# EAGLE design HV Board rev3 (EAGLE 9.0.1)
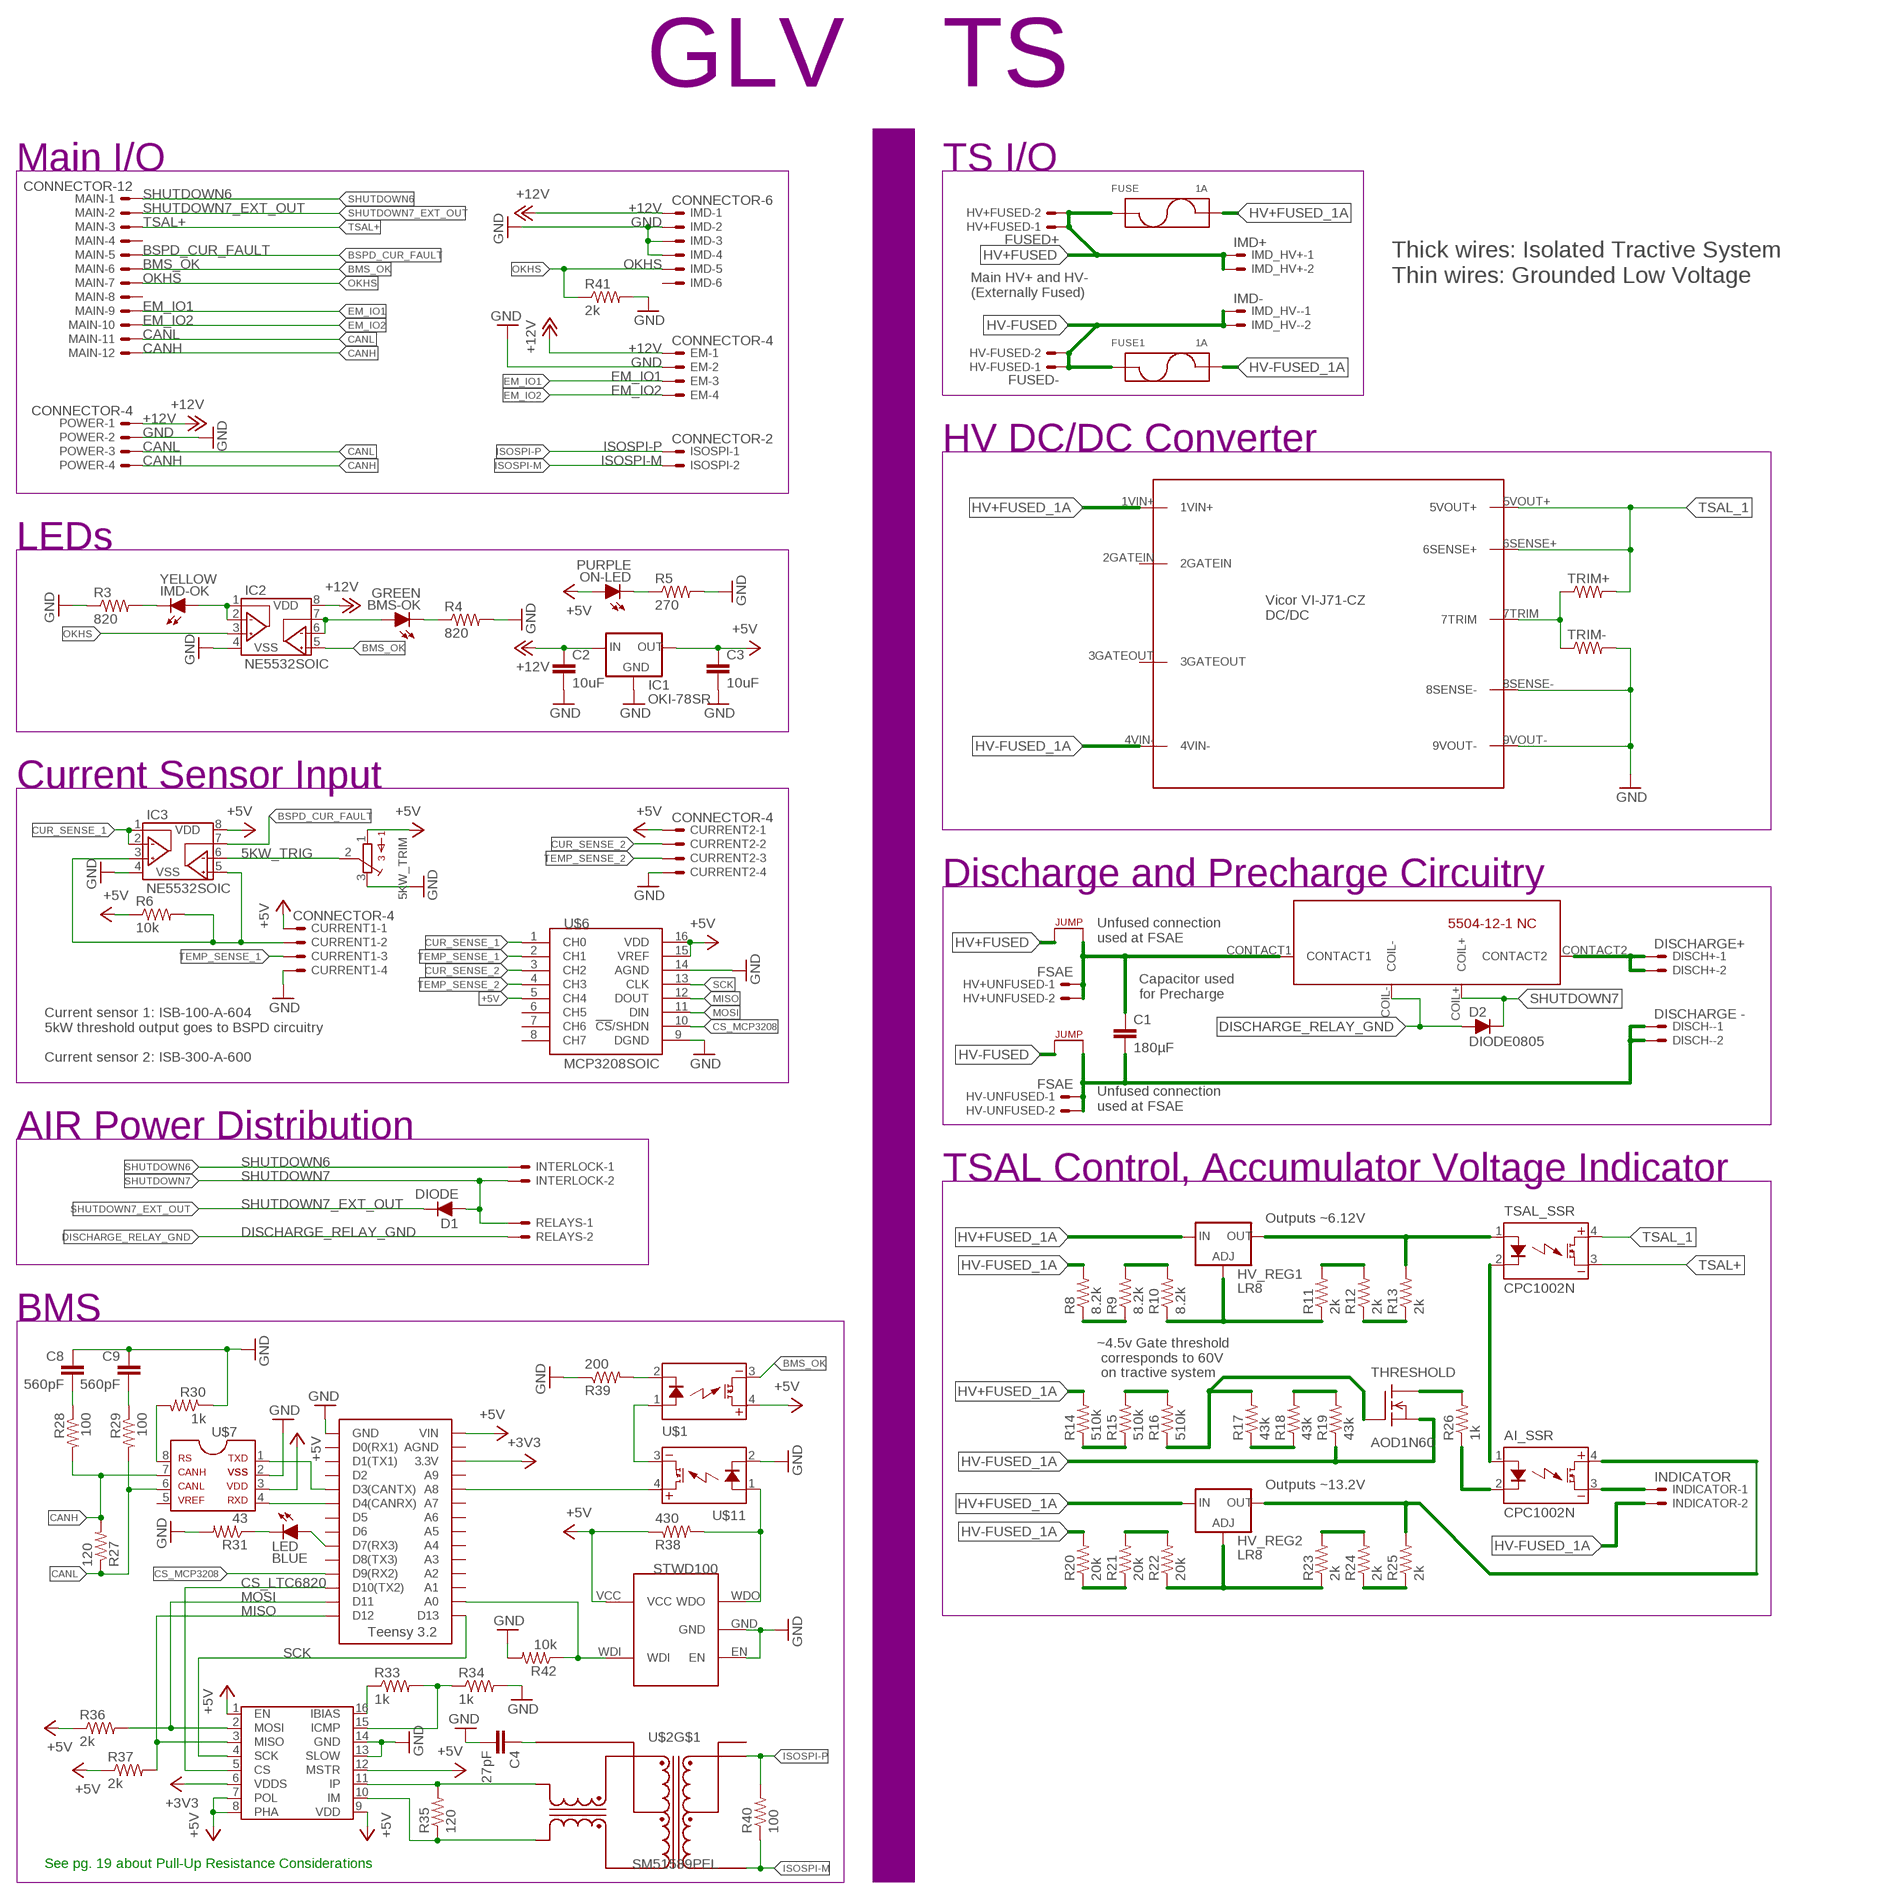
[diagram p0: schematic, sheet 1]

## Parts
5KW_TRIM  TRIMPOT_3296C  [TRIMPOT_3296]
AI_SSR  CPC1002N  [SOP04]
BMS-OK  GREEN  LED-0805  [LED-805]
C1  180µF  CAP  [LLS2V221MELZ]
C2  10uF  CAP0805  [0805]
C3  10uF  CAP0805  [0805]
C4  27pF  CAP0805  [0805]
C8  560pF  CAP0805  [0805]
C9  560pF  CAP0805  [0805]
CURRENT1  CONNECTOR-4  [MINIFIT_5566-4]
CURRENT2  CONNECTOR-4  [MINIFIT_5566-4]
D1  DIODE  DIODEDO-41  [DO-41]
D2  DIODE0805  [0805_D]
DISCH+  DISCHARGE+  MINIFIT_5566-2  [MINIFIT_5566-2]
DISCH-  DISCHARGE -  MINIFIT_5566-2  [MINIFIT_5566-2]
EM  CONNECTOR-4  CONNECTOR-4NANO-FIT-VERTICAL-4  [NANO-FIT_VERTICAL-4]
FUSE  1A  FUSE_5X20MM  [0751.0110]
FUSE1  1A  FUSE_5X20MM  [0751.0110]
HV+FUSED  FUSED+  MINIFIT_5566-2  [MINIFIT_5566-2]
HV+UNFUSED  FSAE  CONNECTOR-2  [MINIFIT_5566-2]
HV-FUSED  FUSED-  MINIFIT_5566-2  [MINIFIT_5566-2]
HV-UNFUSED  FSAE  CONNECTOR-2  [MINIFIT_5566-2]
HV_REG1  LR8  HV_LIN_REG_LR8SMD  [TO-252]
HV_REG2  LR8  HV_LIN_REG_LR8SMD  [TO-252]
IC1  OKI-78SR  [OKI-78SR]
IC2  NE5532SOIC  [SOIC-08]
IC3  NE5532SOIC  [SOIC-08]
IMD  CONNECTOR-6  CONNECTOR-6NANO-FIT_VERTICAL-6  [NANO-FIT_VERTICAL-6]
IMD-OK  YELLOW  LED-0805  [LED-805]
IMD_HV+  IMD+  CONNECTOR-2  [MINIFIT_5566-2]
IMD_HV-  IMD-  CONNECTOR-2  [MINIFIT_5566-2]
INDICATOR  INDICATOR  MINIFIT_5566-2  [MINIFIT_5566-2]
INTERLOCK  MINIFIT_5566-2  [MINIFIT_5566-2]
ISOSPI  CONNECTOR-2  CONNECTOR-2NANO-FIT_VERTICAL-2  [NANO-FIT_VERTICAL-2]
LED  BLUE  LED-0805  [LED-805]
MAIN  CONNECTOR-12  [MINIFIT_5566-12]
ON-LED  PURPLE  LED-0805  [LED-805]
POWER  CONNECTOR-4  [MINIFIT_5566-4]
R3  820  RESISTOR0805-RES  [0805]
R4  820  RESISTOR0805-RES  [0805]
R5  270  RESISTOR0805-RES  [0805]
R6  10k  RESISTOR0805-RES  [0805]
R8  8.2k  RESISTOR0805-RES  [0805]
R9  8.2k  RESISTOR0805-RES  [0805]
R10  8.2k  RESISTOR0805-RES  [0805]
R11  2k  RESISTOR0805-RES  [0805]
R12  2k  RESISTOR0805-RES  [0805]
R13  2k  RESISTOR0805-RES  [0805]
R14  510k  RESISTOR0805-RES  [0805]
R15  510k  RESISTOR0805-RES  [0805]
R16  510k  RESISTOR0805-RES  [0805]
R17  43k  RESISTOR0805-RES  [0805]
R18  43k  RESISTOR0805-RES  [0805]
R19  43k  RESISTOR0805-RES  [0805]
R20  20k  RESISTOR0805-RES  [0805]
R21  20k  RESISTOR0805-RES  [0805]
R22  20k  RESISTOR0805-RES  [0805]
R23  2k  RESISTOR0805-RES  [0805]
R24  2k  RESISTOR0805-RES  [0805]
R25  2k  RESISTOR0805-RES  [0805]
R26  1k  RESISTOR0805-RES  [0805]
R27  120  RESISTOR0805-RES  [0805]
R28  100  RESISTOR0805-RES  [0805]
R29  100  RESISTOR0805-RES  [0805]
R30  1k  RESISTOR0805-RES  [0805]
R31  43  RESISTOR0805-RES  [0805]
R33  1k  RESISTOR0805-RES  [0805]
R34  1k  RESISTOR0805-RES  [0805]
R35  120  RESISTOR0805-RES  [0805]
R36  2k  RESISTOR0805-RES  [0805]
R37  2k  RESISTOR0805-RES  [0805]
R38  430  RESISTOR0805-RES  [0805]
R39  200  RESISTOR0805-RES  [0805]
R40  100  RESISTOR0805-RES  [0805]
R41  2k  RESISTOR0805-RES  [0805]
R42  10k  RESISTOR0805-RES  [0805]
RELAYS  MINIFIT_5566-2  [MINIFIT_5566-2]
THRESHOLD  AOD1N60  N-CHANNEL_MOSFETAOD1N60  [TO-252]
TRIM+  RESISTOR0805-RES  [0805]
TRIM-  RESISTOR0805-RES  [0805]
TSAL_SSR  CPC1002N  [SOP04]
U$1  CPC1002N  [SOP04]
U$2  SM51589PEL  [SM51589PEL]
U$3  JUMPER.3  [AXIAL-0.3]
U$4  JUMPER.3  [AXIAL-0.3]
U$5  HV_DCDC_VI-J71-CZ  [HV_DCDC_VI-J71-CZ]
U$6  MCP3208SOIC  [SOIC-16]
U$7  MCP2551  [SOIC-08]
U$8  LTC6820  [MSOP-16]
U$9  TEENSY_3.2_SIMPLE  [TEENSY_3.2_SIMPLE]
U$10  STWD100  [SOT23-5]
U$11  CPC1002N  [SOP04]
U$12  5504-12-1-NC  [5504-12-1-NC]

## Nets
5KW_TRIG: 5KW_TRIM.2 IC3.6(VINB-)
+3V3: U$8.6(VDDS) U$9.3.3V
+5V: 5KW_TRIM.1 C3.1 CURRENT1.1 CURRENT2.1 IC1.3(OUT) IC3.8(VDD) ON-LED.A R6.1 R36.1 R37.1 R38.1 U$1.4(DC+) U$6.5(CH4) U$6.15(VREF) U$6.16(VDD) U$7.3 U$8.1(EN) U$8.7(POL) U$8.8(PHA) U$8.9(VDD) U$8.12(MSTR) U$9.VIN U$10.VCC
+12V: C2.1 EM.P$1 IC1.1(IN) IC2.8(VDD) IMD.P$1 POWER.1
BMS_OK: IC2.5(VINB+) MAIN.6 U$1.3(DC-)
BMS_WATCH: U$1.1(CONTROL+) U$11.3(DC-)
BSPD_CUR_FAULT: IC3.7(VOUTB) MAIN.5
CANH: MAIN.12 POWER.4 R27.2 R28.2 U$7.7
CANL: MAIN.11 POWER.3 R27.1 R29.2 U$7.6
CS_LTC6820: U$8.5(CS) U$9.D10(TX2)
CS_MCP3208: U$6.10(!CS!/SHDN) U$9.D9(RX2)
CUR_SENSE_1: IC3.1(VOUTA) IC3.2(VINA-) U$6.1(CH0)
CUR_SENSE_1_RAW: CURRENT1.2 IC3.3(VINA+) IC3.5(VINB+) R6.2
CUR_SENSE_2: CURRENT2.2 U$6.3(CH2)
DISCHARGE_RELAY_GND: D2.A RELAYS.2 U$12.COIL-
EM_IO1: EM.P$3 MAIN.9
EM_IO2: EM.P$4 MAIN.10
GND: 5KW_TRIM.3 C2.2 C3.2 C4.2 C8.1 C9.1 CURRENT1.4 CURRENT2.4 EM.P$2 IC1.2(GND) IC2.4(VSS) IC3.4(VSS) IMD.P$2 IMD.P$3 IMD.P$4 POWER.2 R3.1 R4.2 R5.2 R30.1 R31.2 R34.2 R39.1 R41.2 R42.2 TRIM-.2 U$5.8SENSE- U$5.9VOUT- U$6.9(DGND) U$6.14(AGND) U$7.2 U$8.13(SLOW) U$8.14(GND) U$9.GND U$10.EN U$10.GND U$11.2(CONTROL-)
HV+FUSED: FUSE.L1(P1) FUSE.L2(P1) HV+FUSED.1 HV+FUSED.2 IMD_HV+.1 IMD_HV+.2 U$3.P$1
HV+FUSED_1A: FUSE.R1(P2) FUSE.R2(P2) HV_REG1.1(IN) HV_REG2.1(IN) R14.2 U$5.1VIN+
HV+UNFUSED_FSAE: C1.P$1 HV+UNFUSED.1 HV+UNFUSED.2 U$3.P$2 U$12.CONTACT1
HV+UNFUSED_FSAE_DISCHARGE: DISCH+.1 DISCH+.2 U$12.CONTACT2
HV-FUSED: FUSE1.L1(P1) FUSE1.L2(P1) HV-FUSED.1 HV-FUSED.2 IMD_HV-.1 IMD_HV-.2 U$4.P$1
HV-FUSED_1A: FUSE1.R1(P2) FUSE1.R2(P2) INDICATOR.2 R8.2 R19.1 R20.2 THRESHOLD.3(S) U$5.4VIN-
HV-UNFUSED_FSAE: C1.P$2 DISCH-.1 DISCH-.2 HV-UNFUSED.1 HV-UNFUSED.2 U$4.P$2
ISOSPI-M: ISOSPI.P$2 R40.1 U$2.3(MX-)
ISOSPI-P: ISOSPI.P$1 R40.2 U$2.2(MX+)
MISO: R37.2 U$6.12(DOUT) U$8.3(MISO) U$9.D12
MOSI: R36.2 U$6.11(DIN) U$8.2(MOSI) U$9.D11
N$1: AI_SSR.4(DC+) HV_REG2.2(TAB)(OUT) R25.2
N$2: HV_REG1.2(TAB)(OUT) R13.2 TSAL_SSR.1(CONTROL+)
N$3: ON-LED.C R5.1
N$4: R39.2 U$1.2(CONTROL-)
N$5: AI_SSR.2(CONTROL-) R26.1
N$6: AI_SSR.1(CONTROL+) TSAL_SSR.2(CONTROL-)
N$7: AI_SSR.3(DC-) INDICATOR.1
N$8: R8.1 R9.1
N$9: R26.2 THRESHOLD.2(TAB)(D)
N$10: R14.1 R15.1
N$11: R15.2 R16.2
N$12: R17.1 R18.1
N$13: R18.2 R19.2
N$14: R9.2 R10.2
N$15: HV_REG2.3(ADJ) R22.1 R23.1
N$16: R11.2 R12.2
N$17: R12.1 R13.1
N$18: HV_REG1.3(ADJ) R10.1 R11.1
N$19: R23.2 R24.2
N$20: R24.1 R25.1
N$21: R21.2 R22.2
N$22: R16.1 R17.2 THRESHOLD.1(G)
N$23: R20.1 R21.1
N$25: U$7.1 U$9.D3(CANTX)
N$26: R30.2 U$7.8
N$27: C8.2 R28.1
N$28: C9.2 R29.1
N$29: LED.C R31.1
N$31: R33.1 U$8.16(IBIAS)
N$32: R33.2 R34.1 U$8.15(ICMP)
N$33: R35.1 U$2.22(TD-) U$8.10(IM)
N$34: R35.2 U$2.23(TD+) U$8.11(IP)
N$35: C4.1 U$2.24(TCT)
N$36: U$7.4 U$9.D4(CANRX)
N$37: LED.A U$9.D7(RX3)
N$38: R38.2 U$10.WDO U$11.1(CONTROL+)
N$40: U$9.A8 U$11.4(DC+)
N$42: IC2.1(VOUTA) IC2.2(VINA-) IMD-OK.A
N$43: BMS-OK.A IC2.6(VINB-) IC2.7(VOUTB)
N$44: BMS-OK.C R4.1
N$45: IMD-OK.C R3.2
N$50: R42.1 U$9.A0 U$10.WDI
OKHS: IC2.3(VINA+) IMD.P$5 MAIN.7 R41.1
SCK: U$6.13(CLK) U$8.4(SCK) U$9.D13
SHUTDOWN6: INTERLOCK.1 MAIN.1
SHUTDOWN7: D1.A D2.C INTERLOCK.2 RELAYS.1 U$12.COIL+
SHUTDOWN7_EXT_OUT: D1.C MAIN.2
TEMP_SENSE_1: CURRENT1.3 U$6.2(CH1)
TEMP_SENSE_2: CURRENT2.3 U$6.4(CH3)
TRIM: TRIM+.1 TRIM-.1 U$5.7TRIM
TSAL+: MAIN.3 TSAL_SSR.3(DC-)
TSAL_1: TRIM+.2 TSAL_SSR.4(DC+) U$5.5VOUT+ U$5.6SENSE+
Unconnected: IMD.P$6 MAIN.4 MAIN.8 U$2.1(MCT) U$2.4(MCT) U$2.5(MX+) U$2.6(MX-) U$2.7(MCT) U$2.8(MX+) U$2.9(MX-) U$2.10(MCT) U$2.11(MX+) U$2.12(MX-) U$2.13(TD-) U$2.14(TD+) U$2.15(TCT) U$2.16(TD-) U$2.17(TD+) U$2.18(TCT) U$2.19(TD-) U$2.20(TD+) U$2.21(TCT) U$5.2GATEIN U$5.3GATEOUT U$6.6(CH5) U$6.7(CH6) U$6.8(CH7) U$7.5 U$9.A1 U$9.A2 U$9.A3 U$9.A4 U$9.A5 U$9.A6 U$9.A7 U$9.A9 U$9.AGND U$9.D0(RX1) U$9.D1(TX1) U$9.D2 U$9.D5 U$9.D6 U$9.D8(TX3)

## Notes on the sheet
- GLV
- TS
- Main I/O | TS I/O
- Thick wires: Isolated Tractive System
  Thin wires: Grounded Low Voltage
- Main HV+ and HV-
  (Externally Fused)
- HV DC/DC Converter
- LEDs
- Current Sensor Input
- Discharge and Precharge Circuitry
- Unfused connection
  used at FSAE
- Capacitor used
  for Precharge
- Current sensor 1: ISB-100-A-604
  5kW threshold output goes to BSPD circuitry
  
  Current sensor 2: ISB-300-A-600
- Unfused connection
  used at FSAE
- AIR Power Distribution
- TSAL Control, Accumulator Voltage Indicator
- Outputs ~6.12V
- BMS
- ~4.5v Gate threshold
   corresponds to 60V
   on tractive system
- Outputs ~13.2V
- See pg. 19 about Pull-Up Resistance Considerations

## Library data of the parts
5KW_TRIM = HyTechDevices:TRIMPOT_3296: 3296 Series 3/8" Square Trimmer Source <https://github.com/chiengineer/Eagle-Libraries/blob/master/Potentiometers/bourns.lbr>
AI_SSR TSAL_SSR U$1 U$11 = HyTechDevices:CPC1002N: IXYS Solid State Relay .7A
BMS-OK IMD-OK LED ON-LED = HyTechDevices:LED: Light Emitting Diode (LED) Source: Dangerous Prototypes Eagle Library <https://github.com/DangerousPrototypes/Eagle_Part_Library>
C1-C4 C8 C9 = HyTechDevices:CAP: Capacitor Standard 0603 ceramic capacitor, and 0.1" leaded capacitor.
CURRENT1 CURRENT2 POWER = HyTechDevices:CONNECTOR-4: Mini-Fit Junior connector 4 pole Source: http://www.molex.com; OC_FARNELL: unknown; OC_NEWARK: unknown
D1 D2 = HyTechDevices:DIODE: DIODE general purpose rectifier
DISCH+ DISCH- HV+FUSED HV-FUSED INDICATOR INTERLOCK RELAYS = HyTechDevices:MINIFIT_5566-2: Mini-Fit Junior connector 2 pole Source: http://www.molex.com; OC_FARNELL: 1822072; OC_NEWARK: unknown
EM = HyTechDevices:CONNECTOR-4: Mini-Fit Junior connector 4 pole Source: http://www.molex.com
FUSE FUSE1 = HyTechDevices:FUSE: Fuse/Fuseclips Keystone Electronics 3568 Fuse Mouser Part <http://www.mouser.com/ProductDetail/Keystone-Electronics/3568> Datasheet <http://www.mouser.com/ds/2/215/568-742601.pdf> Bussman/Eaton Midget Fuse Clip 1A3400 <http://www.mouser.com/ProductDetail/Bussmann-Eaton/BK-1A3400-09-R/?qs=sGAEpiMZZMuG%252bgnN5hGYGzzlAelq2OxnKqVSMVjq8I4%3d> Schurter 0751.0110 Brass Fuse Clip Datasheet <http://www.mouser.com/ds/2/358/typ_OG__Clip__5x20-2553.pdf>
HV+UNFUSED HV-UNFUSED IMD_HV+ IMD_HV- = HyTechDevices:CONNECTOR-2: Mini-Fit Junior connector 2 pole Source: http://www.molex.com; OC_FARNELL: 1822072; OC_NEWARK: unknown
HV_REG1 HV_REG2 = HyTechDevices:HV_LIN_REG_LR8
IC1 = HyTechDevices:OKI-78SR: Murata OKI-78SR Non-Isolated Switching Regulator DC/DC - Datasheet <https://power.murata.com/data/power/oki-78sr.pdf>
IC2 IC3 = HyTechDevices:NE5532: TI NE5532 Dual Channel Op Amp
IMD = HyTechDevices:CONNECTOR-6: Mini-Fit Junior connector 6 pole Source: http://www.molex.com
ISOSPI = HyTechDevices:CONNECTOR-2: Mini-Fit Junior connector 2 pole Source: http://www.molex.com
MAIN = HyTechDevices:CONNECTOR-12: Mini-Fit Junior connector 12 pole Source: http://www.molex.com; OC_FARNELL: unknown; OC_NEWARK: unknown
R3-R6 R8-R31 R33-R42 TRIM+ TRIM- = HyTechDevices:RESISTOR: Resistor Basic schematic elements and footprints for 0603, 1206, and PTH resistors.
THRESHOLD = HyTechDevices:N-CHANNEL_MOSFET: Generic N-Channel MOSFET
U$2 = HyTechDevices:SM51589PEL: Bourns High Isolation LAN Transformer Module 5000 VAC Isolation Turns Ratio: 1CT:1CT Inductance: 350 uH Leakage Inductance: 0.5 uH Datasheet <http://www.mouser.com/ds/2/54/m51589pel-778121.pdf>
U$3 U$4 = HyTechDevices:JUMPER: Jumper for changing operation of a device
U$5 = HyTechDevices:HV_DCDC_VI-J71-CZ: Vicor-Corporation VI-J71-CZ Product Page <https://www.digikey.com/product-detail/en/vicor-corporation/VI-J71-CZ/1102-1486-ND/2996194> Datasheet <http://cdn.vicorpower.com/documents/datasheets/ds_vi-j00.pdf>
U$6 = HyTechDevices:MCP3208: Analog to Digital Converter
U$7 = HyTechDevices:MCP2551: MCP2551 High-Speed CAN Transceiver Product Webpage <https://www.microchip.com/wwwproducts/en/MCP2551> Datasheet <http://ww1.microchip.com/downloads/en/DeviceDoc/21667f.pdf> This device is outdated It is replaced by MCP2561. Comparison Page <https://www.microchip.com/wwwproducts/ProductCompare/MCP2551/MCP2561> Product Webpage <https://www.microchip.com/wwwproducts/en/MCP2561> Datasheet <http://ww1.microchip.com/downloads/en/DeviceDoc/20005167C.pdf>
U$8 = HyTechDevices:LTC6820: Linear Technology isoSPI Isolated Communications Interface Datasheet <http://cds.linear.com/docs/en/datasheet/6820fb.pdf>
U$9 = HyTechDevices:TEENSY_3.2_SIMPLE: Simple version of the Teensy 3.2 board that only uses the 2 main rows of pins, not the inner pins or the pins opposite the usb port.
U$10 = HyTechDevices:STWD100: STWD100 Watchdog timer
U$12 = HyTechDevices:5504-12-1-NC: Relay 5504-12-1 Normally Closed(Form B)

## Board
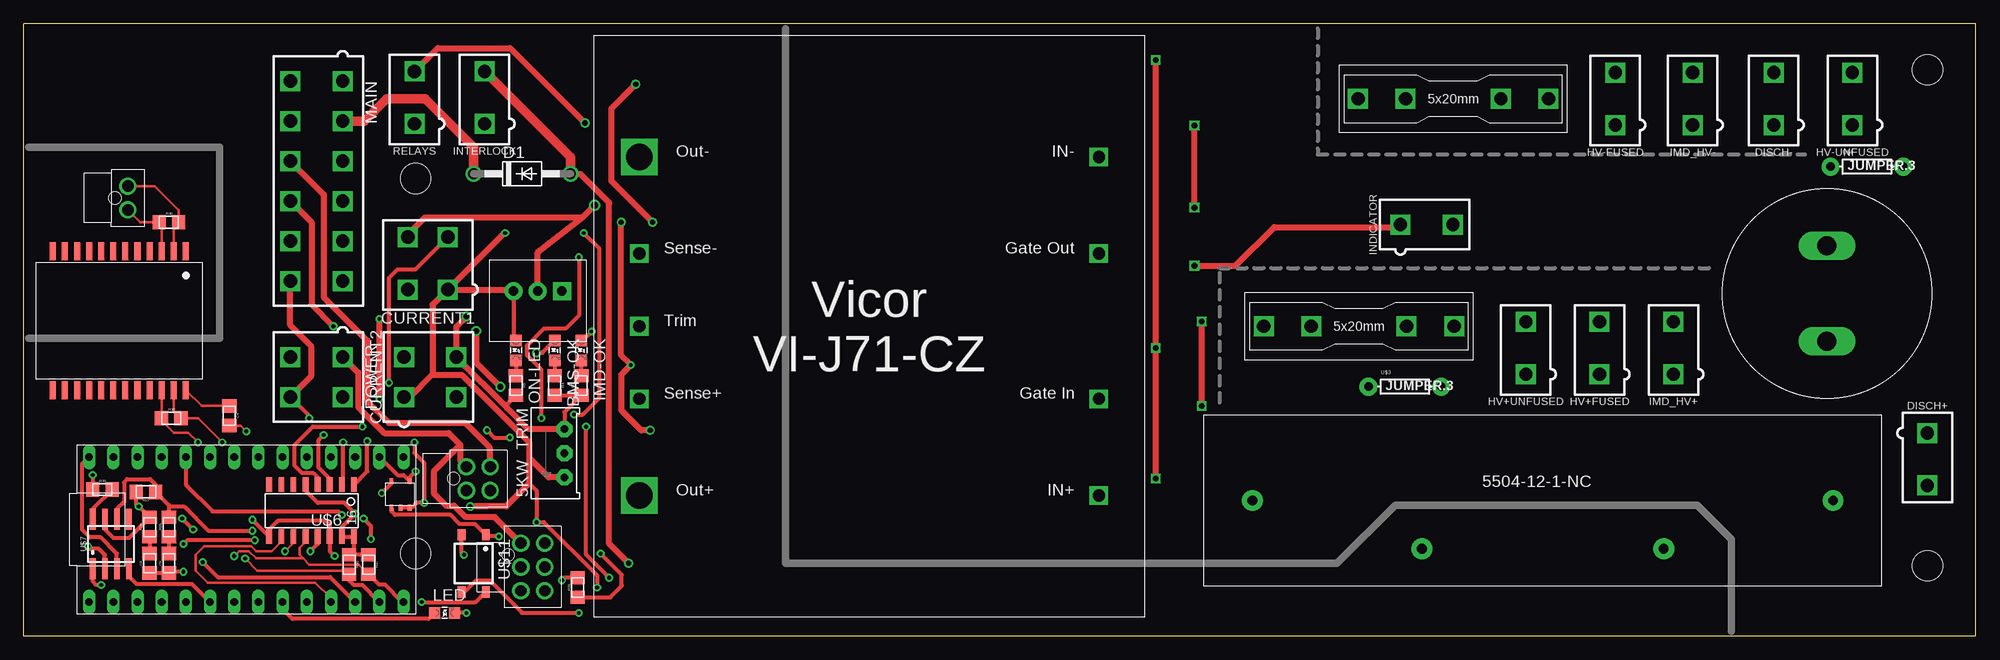
[diagram p1: board, top side]
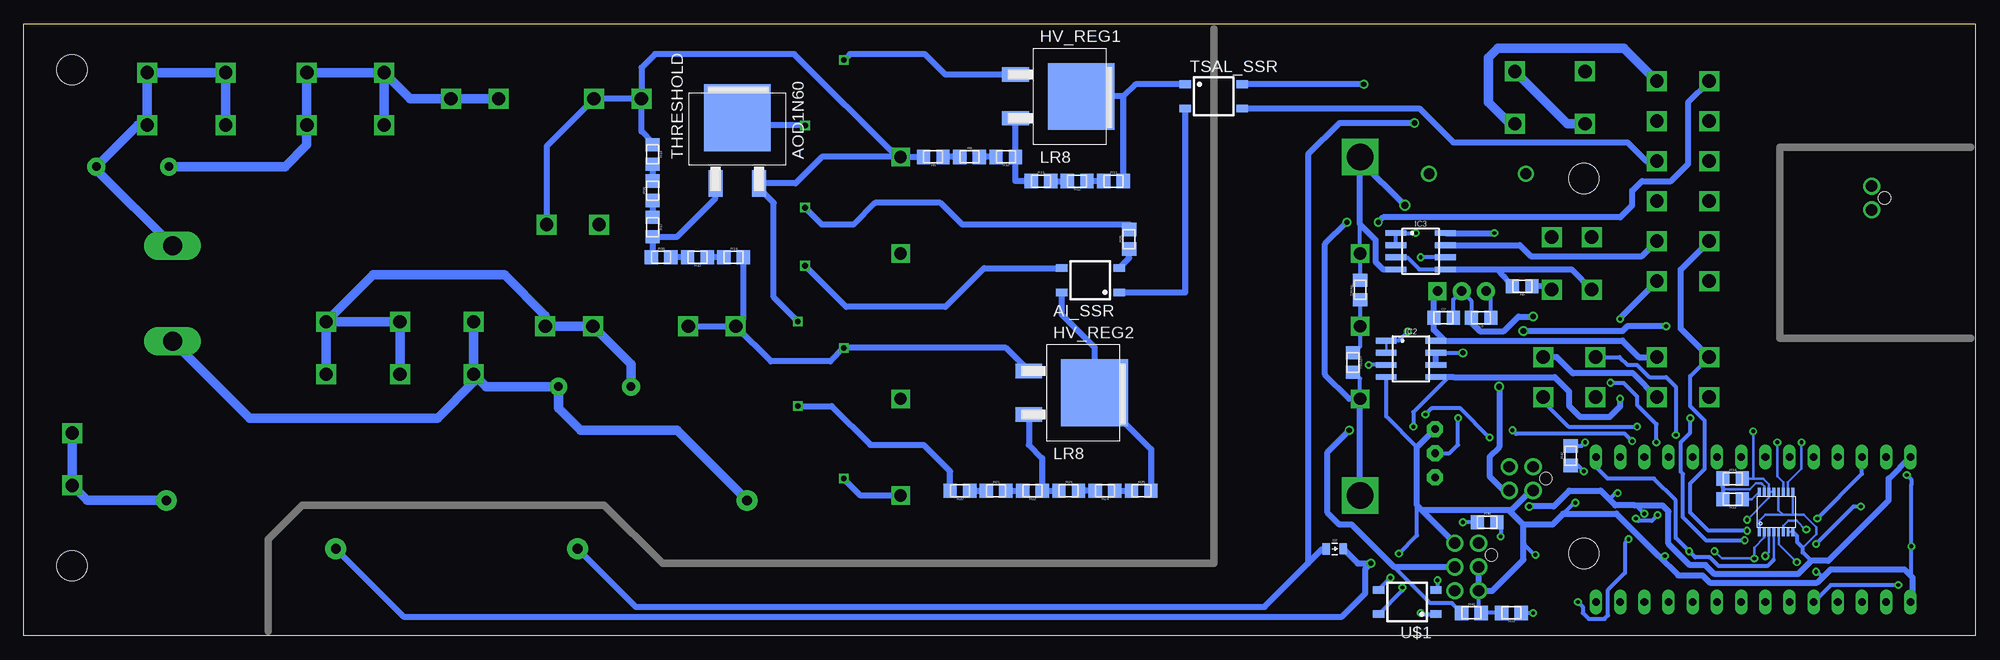
[diagram p2: board, bottom side, seen from below]

Size 204.98 x 64.26 mm. Coordinates in mm from the lower left corner, seen from the top.
Outline: 0,0 204.98,0 204.98,64.26 0,64.26 0,0
Copper layers (1*16): Top 0.035mm / dielectric 1.5mm / Bottom 0.035mm
Design rules "DRC Advanced Circuits": minimum track width 6mil, minimum drill 15mil, track to track 6mil, track to pad 6mil, pad to pad 6mil, via to via 6mil, smd to smd 6mil, copper to edge 40mil, drill to drill 6mil, minimum pad ring 10mil, minimum via ring 8mil, stop-mask expansion 4mil, vias tented up to drill 0mil, thermal gap 10mil
Holes 3.2 mm at 41.15,48.01 41.15,8.64 199.9,7.37 199.9,59.44

### Footprints (pad centres in the part's own frame; a part is rotated, then mirrored left to right if it is on the bottom)
TRIMPOT_3296 = drill 0.813 pad 1.676 octagon: 1 2.54,1.27; 2 0,1.27; 3 -2.54,1.27
SOP04 = smd 0.8 x 1.2: 1 -1.27,-3; 2 1.27,-3; 3 1.27,3; 4 -1.27,3
LED-805 = smd 1.2 x 1.2: A 0,-1.05; C 0,1.05
LLS2V221MELZ = drill 2 long: P$1 -5,0; P$2 5,0
0805 = smd 1.4 x 1.5: 1 -1.025,0; 2 1.025,0
MINIFIT_5566-4 = drill 1.4 square: 1 2.1,-2.75; 2 -2.1,-2.75; 3 2.1,2.75; 4 -2.1,2.75
DO-41 = drill 1.118: A 5.08,0; C -5.08,0
0805_D = smd 0.8 x 1.2: A -0.9,0; C 0.9,0
MINIFIT_5566-2 = drill 1.4 square: 1 0,-2.75; 2 0,2.75
NANO-FIT_VERTICAL-4 = drill 1.2: P$1 -1.25,0; P$2 1.25,0; P$3 -1.25,2.5; P$4 1.25,2.5 | hole 1.3: 0,-1.34
0751.0110 = drill 1.4 square: L1 -10,0; L2 -5,0; R1 5,0; R2 10,0
TO-252 = smd 1.499 x 2.794: 1 -2.286,0; 3 2.286,0 | smd 7.01 x 7.01: 2(TAB) 0,6.909
OKI-78SR = drill 1 pad 1.88 square: 1 -2.54,0 | drill 1 pad 1.88: 2 0,0; 3 2.54,0
SOIC-08 = smd 0.6 x 2.2: 1 -1.905,-2.6; 2 -0.635,-2.6; 3 0.635,-2.6; 4 1.905,-2.6; 5 1.905,2.6; 6 0.635,2.6; 7 -0.635,2.6; 8 -1.905,2.6
NANO-FIT_VERTICAL-6 = drill 1.2: P$1 -2.5,0; P$2 0,0; P$3 2.5,0; P$4 -2.5,2.5; P$5 0,2.5; P$6 2.5,2.5 | hole 1.3: -1.25,-1.34
NANO-FIT_VERTICAL-2 = drill 1.2: P$1 -1.25,0; P$2 1.25,0 | hole 1.3: 0,-1.34
MINIFIT_5566-12 = drill 1.4 square: 1 10.5,-2.75; 2 6.3,-2.75; 3 2.1,-2.75; 4 -2.1,-2.75; 5 -6.3,-2.75; 6 -10.5,-2.75; 7 10.5,2.75; 8 6.3,2.75; 9 2.1,2.75; 10 -2.1,2.75; 11 -6.3,2.75; 12 -10.5,2.75
SM51589PEL = smd 0.635 x 1.905: 1 0,0; 2 1.27,0; 3 2.54,0; 4 3.81,0; 5 5.08,0; 6 6.35,0; 7 7.62,0; 8 8.89,0; 9 10.16,0; 10 11.43,0; 11 12.7,0; 12 13.97,0; 13 13.97,14.605; 14 12.7,14.605; 15 11.43,14.605; 16 10.16,14.605; 17 8.89,14.605; 18 7.62,14.605; 19 6.35,14.605; 20 5.08,14.605; 21 3.81,14.605; 22 2.54,14.605; 23 1.27,14.605; 24 0,14.605
AXIAL-0.3 = drill 0.9 pad 1.88: P$1 -3.81,0; P$2 3.81,0
HV_DCDC_VI-J71-CZ = drill 1.3 square: 1VIN+ 5.08,-12.7; 2GATEIN 5.08,-22.86; 3GATEOUT 5.08,-38.1; 4VIN- 5.08,-48.26; 6SENSE+ 53.34,-22.86; 7TRIM 53.34,-30.48; 8SENSE- 53.34,-38.1 | drill 2.8 square: 5VOUT+ 53.34,-12.7; 9VOUT- 53.34,-48.26
SOIC-16 = smd 0.61 x 1.524: 1 -4.445,-2.794; 2 -3.175,-2.794; 3 -1.905,-2.794; 4 -0.635,-2.794; 5 0.635,-2.794; 6 1.905,-2.794; 7 3.175,-2.794; 8 4.445,-2.794; 9 4.445,2.667; 10 3.175,2.667; 11 1.905,2.667; 12 0.635,2.667; 13 -0.635,2.667; 14 -1.905,2.667; 15 -3.175,2.667; 16 -4.445,2.667
MSOP-16 = smd 0.305 x 0.889: 1 -0.1,-0.5; 2 0.4,-0.5; 3 0.9,-0.5; 4 1.4,-0.5; 5 1.9,-0.5; 6 2.4,-0.5; 7 2.9,-0.5; 8 3.4,-0.5; 9 3.4,3.7; 10 2.9,3.7; 11 2.4,3.7; 12 1.9,3.7; 13 1.4,3.7; 14 0.9,3.7; 15 0.4,3.7; 16 -0.1,3.7
TEENSY_3.2_SIMPLE = drill 0.8 long: 3.3V 16.51,29.21; A0 16.51,3.81; A1 16.51,6.35; A2 16.51,8.89; A3 16.51,11.43; A4 16.51,13.97; A5 16.51,16.51; A6 16.51,19.05; A7 16.51,21.59; A8 16.51,24.13; A9 16.51,26.67; AGND 16.51,31.75; D0(RX1) 1.27,31.75; D1(TX1) 1.27,29.21; D2 1.27,26.67; D3(CANTX) 1.27,24.13; D4(CANRX) 1.27,21.59; D5 1.27,19.05; D6 1.27,16.51; D7(RX3) 1.27,13.97; D8(TX3) 1.27,11.43; D9(RX2) 1.27,8.89; D10(TX2) 1.27,6.35; D11 1.27,3.81; D12 1.27,1.27; D13 16.51,1.27; GND 1.27,34.29; VIN 16.51,34.29
SOT23-5 = smd 0.61 x 0.406: EN -2.794,0; GND -2.794,0.94; VCC 0,1.905; WDI 0,0; WDO -2.794,1.905
5504-12-1-NC = drill 1.016 pad 2.184: COIL+ 48.26,-14.097; COIL- 22.86,-14.097; CONTACT1 5.08,-9.017; CONTACT2 66.04,-9.017

### Placement (x,y rotation side)
5KW_TRIM  55.5,19.18 270 top
AI_SSR  92.96,37.34 90 bottom
BMS-OK  55.75,29.97 180 top
C1  189.36,35.94 90 top
C2  55.88,33.4 0 bottom
C3  51.94,33.4 180 bottom
C4  21.59,23.11 270 top
C8  13.21,7.62 90 top
C9  15.24,7.62 90 top
CURRENT1  42.42,39.12 0 top
CURRENT2  42.67,27.18 270 top
D1  52.32,48.51 0 top
D2  67.31,9.14 0 bottom
DISCH+  199.9,18.54 180 top
DISCH-  183.77,56.39 0 top
EM  46.48,16.51 270 top
FUSE  140.21,32.51 180 top
FUSE1  150.11,56.39 180 top
HV+FUSED  165.48,30.23 0 top
HV+UNFUSED  157.73,30.23 0 top
HV-FUSED  167.13,56.39 0 top
HV-UNFUSED  192.02,56.39 0 top
HV_REG1  100.84,56.64 270 bottom
HV_REG2  99.44,25.53 270 bottom
IC1  53.98,36.2 180 top
IC2  59.31,29.08 270 bottom
IC3  58.29,40.39 270 bottom
IMD  52.2,7.24 270 top
IMD-OK  58.55,29.97 180 top
IMD_HV+  173.23,30.23 0 top
IMD_HV-  175.26,56.39 0 top
INDICATOR  147.32,43.18 270 top
INTERLOCK  48.39,56.52 0 top
ISOSPI  10.92,45.97 270 top
LED  44.2,2.41 270 top
MAIN  30.73,47.75 90 top
ON-LED  51.69,29.97 180 top
POWER  30.73,27.18 90 top
R3  58.55,26.29 90 top
R4  55.75,26.29 270 top
R5  51.69,26.29 270 top
R6  47.62,36.7 180 bottom
R8  109.47,50.29 180 bottom
R9  105.66,50.29 0 bottom
R10  101.85,50.29 180 bottom
R11  98.17,47.75 0 bottom
R12  94.36,47.75 180 bottom
R13  90.55,47.75 0 bottom
R14  130.43,39.75 0 bottom
R15  134.24,39.75 180 bottom
R16  138.05,39.75 0 bottom
R17  138.94,42.93 270 bottom
R18  138.94,46.74 90 bottom
R19  138.94,50.55 270 bottom
R20  106.68,15.24 180 bottom
R21  102.87,15.24 0 bottom
R22  99.06,15.24 180 bottom
R23  95.25,15.24 0 bottom
R24  91.44,15.24 180 bottom
R25  87.63,15.24 0 bottom
R26  88.9,41.66 90 bottom
R27  12.83,15.11 180 top
R28  13.21,11.43 90 top
R29  15.24,11.43 90 top
R30  8.26,15.37 0 top
R31  48.77,2.41 180 bottom
R33  25.53,14.35 180 bottom
R34  25.53,16.51 0 bottom
R35  15.49,22.86 0 top
R36  34.16,7.49 270 top
R37  36.2,7.49 270 top
R38  51.31,11.94 0 bottom
R39  58.17,5.08 90 top
R40  15.24,43.43 0 top
R41  52.96,2.41 0 bottom
R42  42.55,18.92 90 bottom
RELAYS  41.02,56.52 0 top
THRESHOLD  130.05,47.5 0 bottom
TRIM+  65.41,28.7 270 bottom
TRIM-  64.64,36.32 90 bottom
TSAL_SSR  80.01,56.64 270 bottom
U$1  59.69,3.56 90 bottom
U$2  17.02,40.39 180 top
U$3  145.03,26.16 0 top
U$4  193.55,49.28 0 top
U$5  117.98,2.03 180 top
U$6  30.23,13.08 180 top
U$7  9.14,9.65 0 top
U$8  22.61,11.43 0 bottom
U$9  41.15,2.29 90 top
U$10  40.51,16.26 90 top
U$11  47.24,7.62 180 top
U$12  123.95,23.24 0 top

### Tracks (layer width: path | path; a pad name or v marks a point on that pad's centre or on a via)
5KW_TRIG  (via drill 0.4)
  Top 0.406: v54.36,22.86 54.36,27.94 52.83,29.46 52.83,30.48 54.61,32.26 56.9,32.26 58.29,33.66 v58.29,39.75
  Bottom 0.406: 5KW_TRIM.2 55.24,19.18 54.36,20.07 v54.36,22.86 | IC3.6 v58.29,39.75
+3V3  (via drill 0.4)
  Top 0.406: v17.79,11.16 v16.64,12.32
  Bottom 0.254: U$8.6 20.21,11.54 19.68,12.06 18.8,12.06 17.9,11.16 v17.79,11.16
  Bottom 0.406: U$9.3.3V 11.94,17.02 v16.64,12.32
+5V  (via drill 0.4, 0.5)
  Top 0.406: R37.1 R36.1 34.67,9.03 U$6.16 U$6.15 33.4,11.43 v34.8,12.83 33.66,13.97 30.86,13.97 29.59,15.24 U$6.5 | U$7.3 9.78,8.64 8.06,10.36 6.92,10.36 6.1,11.18 6.1,18.03 U$9.VIN | U$10.VCC 38.61,16 v37.59,14.99 | 53.09,16 53.85,15.24 v53.85,11.94 54.61,11.94 60.2,6.35 v60.2,5.08 | IC1.3 51.44,31.28 ON-LED.A
  Top 0.61: 42.9,27.41 42.93,27.43 42.93,34.77 CURRENT1.1 | 42.9,27.41 40.57,25.08 CURRENT2.1 | 42.9,27.41 46,27.41 53.09,20.32 53.09,18.68 | 53.09,18.68 53.09,16 50.67,13.59 v46.88,13.59 | 5KW_TRIM.1 55.13,16.64 53.09,18.68 | CURRENT1.1 51.26,36.37 IC1.3 | v50.55,42.29 50.44,42.29 CURRENT1.1
  Bottom 0.254: U$8.1 22.71,12.09 22.1,12.7 20.19,12.7 | 20.19,12.7 19.25,12.7 | U$8.12 20.71,13.22 20.19,12.7 | U$8.9 19.21,12.74 19.25,12.7 | 19.25,12.7 18.03,12.7 16.76,11.43 16.76,10.67 18.16,9.27 | U$8.8 U$8.7
  Bottom 0.406: U$8.8 18.74,10.47 18.74,9.85 18.16,9.27 18.16,8.76 17.27,7.87 | v37.59,14.99 37.85,14.99 38.48,14.35 | R38.1 v53.85,11.94 | C3.1 50.92,35.68 IC1.3 | v34.8,12.83 35.69,13.72 35.81,13.72 | U$1.4 60.2,4.78 v60.2,5.08
  Bottom 0.61: CURRENT1.1 44.85,36.7 R6.1 | v46.88,13.59 44.32,13.59 42.67,15.24 39.37,15.24 38.48,14.35 37.85,13.72 35.81,13.72 32.89,13.72 32.26,13.08 32.26,9.65 30.04,7.43 28.38,7.43 27.43,6.48 18.67,6.48 17.27,7.87 15.49,7.87 9.14,14.22 9.14,16.51 U$9.VIN | IC3.8 v50.55,42.29
+12V
  Top 0.61: POWER.1 35.13,27.63 35.13,24.02 37.86,21.29 44.63,21.29 45.85,20.07 | 45.85,20.07 45.85,18.39 EM.P$1 | IMD.P$1 49.46,12.48 46.4,12.48 45.19,13.69 44.35,13.69 43.05,14.99 43.05,17.27 45.85,20.07
  Bottom 0.61: 55.75,30.99 IC2.8 | 55.75,30.99 37.08,30.99 35.37,29.28 POWER.1 | 55.75,30.99 56.91,32.14 C2.1 56.91,35.8 IC1.1
BMS_OK  (via drill 0.4)
  Top 0.406: v59.05,21.97 59.05,8.51 v61.47,6.1
  Top 0.61: v37.34,33.27 v37.34,24.89
  Bottom 0.406: 54.86,27.18 55.37,27.18 59.05,23.5 v59.05,21.97 | U$1.3 62.69,4.87 v61.47,6.1
  Bottom 0.61: IC2.5 54.86,27.18 44.2,27.18 42.67,25.65 42.67,24.13 41.52,22.98 38.47,22.98 37.34,24.11 v37.34,24.89 | MAIN.6 37.34,33.4 v37.34,33.27
BMS_WATCH  (via drill 0.4)
  Top 0.406: v58.29,2.41 52.32,2.41 48.9,5.84 47.5,5.84 46.28,4.62 U$11.3
  Bottom 0.406: v58.29,2.41 58.17,2.29 U$1.1
BSPD_CUR_FAULT
  Bottom 0.61: IC3.7 47.88,41.02 46.74,39.88 35.06,39.88 MAIN.5
CANH  (via drill 0.4, 0.45)
  Top 0.406: v29.97,22.86 29.97,23.09 POWER.4 | R27.2 11.8,13.86 v12.07,13.59 R28.2 11.94,11.19 11.94,11.18 11.05,10.29 9.4,10.29 8.51,11.18 U$7.7 | v24.26,10.03 17.14,10.03 v16.76,9.65
  Top 0.61: POWER.4 30.23,27.32 30.23,30.35 27.98,32.59 MAIN.12
  Bottom 0.406: v29.97,22.86 29.97,21.34 30.99,20.32 30.99,17.27 30.73,17.02 30.73,12.45 28.32,10.03 v24.26,10.03 | v16.76,9.65 12.82,13.59 v12.07,13.59
CANL  (via drill 0.4)
  Top 0.406: U$7.6 9.78,13.34 10.54,14.1 10.54,16.13 10.86,16.45 13.27,16.45 13.84,15.88 13.84,14.61 R27.1 15.24,13.72 | 15.24,13.22 R29.2 15.24,13.72 | 15.24,13.72 15.37,13.59 16.82,13.59 19.37,11.05 v24,11.05
  Bottom 0.406: 27.98,29.25 29.97,27.27 29.97,24.13 28.45,22.61 28.45,17.53 29.97,16 29.97,12.95 28.06,11.05 v24,11.05
  Bottom 0.61: POWER.3 27.98,29.25 30.99,32.26 30.99,38.45 MAIN.11
CS_LTC6820  (via drill 0.4)
  Top 0.406: v18.8,7.75 20.38,6.16 32.19,6.16 U$9.D10(TX2)
  Bottom 0.254: U$8.5 20.69,10.91 20.69,9.64 v18.8,7.75
CS_MCP3208
  Top 0.254: U$6.10 27.05,9.91 26.04,8.89 24.38,8.89 23.88,9.4 18.92,9.4 18.03,8.51 18.03,6.86 19.3,5.59 30.61,5.59 32.26,3.94 U$9.D9(RX2)
CUR_SENSE_1  (via drill 0.4)
  Top 0.406: U$6.1 36.07,17.27 v36.07,20.45 | v58.8,42.29 60.45,40.64 60.45,25.02 58.67,23.24 v57.78,23.24 | v48.64,21.59 49.4,20.83 v51.05,20.83
  Bottom 0.406: IC3.2 IC3.1 v58.8,42.29 | v36.07,20.45 36.83,21.21 48.26,21.21 v48.64,21.59 | v51.05,20.83 54.1,23.88 57.15,23.88 v57.78,23.24
CUR_SENSE_1_RAW
  Bottom 0.406: IC3.3 59.69,39.75 58.42,38.48 IC3.5
  Bottom 0.61: IC3.5 50.29,38.48 | R6.2 49.53,37.72 50.29,38.48 | CURRENT1.2 42.43,38.48 50.29,38.48
CUR_SENSE_2  (via drill 0.4)
  Top 0.406: U$6.3 32.13,16.51 30.99,17.65 30.99,20.57 v31.5,21.08
  Bottom 0.406: CURRENT2.2 37.41,29.28 36.58,28.45 35.56,28.45 34.29,27.18 32.51,27.18 31.5,26.16 v31.5,21.08
DISCHARGE_RELAY_GND  (via drill 0.55)
  Top 0.61: RELAYS.2 43.48,61.72 51.05,61.72 v58.93,53.85
  Bottom 0.61: U$12.COIL- 140.72,3.05 74.68,3.05 70.1,7.62 | D2.A 68.58,9.14 70.1,7.62 | 70.1,7.62 70.1,50.55 66.8,53.85 v58.93,53.85
EM_IO1
  Top 0.61: MAIN.9 31.5,46.34 31.5,35.56 36.07,30.99 36.07,24.61 38.32,22.35 46.35,22.35 48.9,19.81 48.9,17.85 EM.P$3
EM_IO2  (via drill 0.45, 0.6)
  Top 0.61: MAIN.10 28.01,45.65 30.23,43.43 30.23,34.8 v32.51,32.51 | v47.5,32 47.5,28.7 v50.04,26.16
  Bottom 0.61: EM.P$4 49.55,15.26 51.05,16.76 51.05,18.8 50.04,19.81 v50.04,26.16 | v32.51,32.51 36.58,32.51 37.08,32 v47.5,32
GND  (via drill 0.4, 0.45, 0.55, 0.75)
  Top 0.254: C4.2 22.75,22.09 v23.37,21.47
  Top 0.406: R4.2 R3.1 56.77,23.49 5KW_TRIM.3 | C8.1 C9.1 15.38,6.73 v16.76,6.73 | U$10.GND U$10.EN 40.77,13.46 41.27,13.97 v42.04,13.97 42.04,18.16 41.02,19.18 v41.02,20.32 | U$7.2 8.51,8.51 7.87,9.14 7.01,9.14 v6.75,9.4 | v7.24,16.89 v7.23,16.88 R30.1 | R39.1 61.59,4.05 62.8,5.27 62.8,6.41 v60.58,8.64 | v24,12.19 U$6.9 25.78,11.18 26.67,12.06 31.75,12.06 32.13,11.68 U$6.14 32.13,8.89 v32.64,8.38 | R5.2 50.75,24.32 50.75,23.95 | v46.23,8.51 45.97,8.76 U$11.2
  Top 0.61: IC1.2 53.98,40.26 58.67,43.94 | 5KW_TRIM.3 52.98,21.72 50.75,23.95 CURRENT2.4 45.42,32.47 v46.48,33.53 | CURRENT1.4 40.32,42.12 42.14,43.94 58.67,43.94 | 58.67,43.94 v59.94,45.21
  Bottom 0.254: U$8.14 U$8.13 | U$8.14 21.72,15.15 21.72,15.93 22.3,16.51 23.37,16.51 | 23.37,16.51 R34.2 | 23.37,16.51 v23.37,21.47 | v24,12.19 21.71,14.49 U$8.14
  Bottom 0.406: TRIM-.2 U$5.8SENSE- 64.64,43.2 | 6.66,6.15 6.75,6.25 v6.75,9.4 6.75,15.9 6.73,15.92 6.73,16.38 v7.24,16.89 | v16.76,6.73 16.64,6.73 16.07,6.16 | v42.04,13.97 42.16,13.97 43.31,12.83 | R42.2 41.39,19.95 v41.02,20.32 | R31.2 R41.2 52.2,2.68 IMD.P$3 | 58.67,19.81 61.91,23.05 IC2.4 | C3.2 52.97,35.19 IC1.2 54.85,35.31 C2.2 | v32.64,8.38 33.27,8.38 | 47.5,9.65 46.35,8.51 v46.23,8.51 | v60.58,8.64 58.67,10.54 58.67,13.72
  Bottom 0.61: 64.77,50.29 U$5.9VOUT- 64.64,49.91 | 64.64,49.91 64.64,43.2 62.99,41.55 62.99,39.24 62.23,38.48 IC3.4 | v59.94,45.21 64.64,49.91 | POWER.2 35.97,27.56 42.29,27.56 44.01,29.28 CURRENT2.4 | U$9.GND 6.66,3.76 6.66,6.15 7.49,6.99 15.24,6.99 16.07,6.16 16.64,5.59 27.94,5.59 28.7,6.35 31.24,6.35 33.27,8.38 37.72,12.83 43.31,12.83 44.45,11.68 47.5,11.68 | IMD.P$2 IMD.P$3 50.76,4.74 47.5,8 47.5,9.65 47.5,11.68 | 5KW_TRIM.3 58.67,19.81 58.67,13.72 58.17,13.21 | 58.17,13.21 IMD.P$4 | 49.02,13.21 48.77,13.21 46.72,15.26 EM.P$2 | 49.02,13.21 58.17,13.21 | 47.5,11.68 49.02,13.21 | C3.2 52.97,32.9 52.07,32 49.53,32 48.01,33.53 v46.48,33.53
HV+FUSED
  Bottom 1.016: HV+FUSED.1 HV+FUSED.2 IMD_HV+.2 | IMD_HV+.1 IMD_HV+.2 | U$3.P$1 141.22,28.53 FUSE.L2 FUSE.L1 150.21,33.62 154.5,37.91 168.29,37.91 IMD_HV+.2
HV+FUSED_1A  (via drill 0.6)
  Top 0.61: v118.87,60.45 v118.87,30.23 v118.87,16.51
  Bottom 0.61: HV_REG1.1 108.2,58.93 110.36,61.09 118.24,61.09 v118.87,60.45 | HV_REG2.1 101.85,30.23 v118.87,30.23 120.27,28.83 126.53,28.83 FUSE.R2 | U$5.1VIN+ 117.09,14.73 v118.87,16.51 | FUSE.R1 FUSE.R2 | FUSE.R2 129.4,33.32 R14.2
HV+UNFUSED_FSAE
  Bottom 1.016: HV+UNFUSED.1 HV+UNFUSED.2 | HV+UNFUSED.1 156.42,26.16 U$3.P$2 148.79,25.72 148.79,23.88 146.5,21.59 136.4,21.59 U$12.CONTACT1 | HV+UNFUSED.1 157.73,26.67 161.54,22.86 181.28,22.86 C1.P$1
HV+UNFUSED_FSAE_DISCHARGE
  Bottom 1.016: DISCH+.1 DISCH+.2 198.33,14.22 U$12.CONTACT2
HV-FUSED
  Bottom 1.016: HV-FUSED.2 HV-FUSED.1 | FUSE1.L2 FUSE1.L1 164.38,56.39 HV-FUSED.2 | HV-FUSED.2 IMD_HV-.2 IMD_HV-.1 175.26,51.56 177.55,49.28 U$4.P$1
HV-FUSED_1A  (via drill 0.6)
  Top 0.61: v123.7,24.13 v123.7,33.02
  Bottom 0.61: 113.28,50.29 U$5.4VIN- R8.2 | FUSE1.R2 FUSE1.R1 150.07,51.43 INDICATOR.2 | v123.7,24.13 120.14,24.13 116.08,20.07 110.49,20.07 107.7,17.28 R20.2 | v123.7,33.02 126.24,35.56 126.24,45.47 127.76,46.99 THRESHOLD.3 123.95,47.5 121.16,50.29 113.28,50.29 | FUSE1.R2 140.11,52.96 138.94,51.78 R19.1 | 113.28,50.29 124.08,61.09 138.68,61.09 140.11,59.66 FUSE1.R2
HV-UNFUSED_FSAE
  Bottom 1.016: DISCH-.1 DISCH-.2 HV-UNFUSED.2 HV-UNFUSED.1 193,53.64 U$4.P$2 197.36,48.94 C1.P$2
ISOSPI-M
  Top 0.254: U$2.3 14.48,43.31 14.37,43.42 R40.1 12.21,43.43 ISOSPI.P$2
ISOSPI-P
  Top 0.254: U$2.2 15.75,43.04 R40.2 16.27,44.7 13.74,47.22 ISOSPI.P$1
MISO  (via drill 0.45)
  Top 0.254: v22.1,8.38 22.61,8.89 23.62,8.89 24.38,8.13 29.34,8.13 | R37.2 36.13,6.54 35.17,7.49 29.97,7.49 29.34,8.13 | 29.34,8.13 28.96,8.51 28.96,9.27 29.59,9.91 U$6.12
  Top 0.406: 36.13,6.54 37.27,5.4 37.91,5.4 39.75,3.56 U$9.D12
  Bottom 0.254: v22.1,8.38 21.71,8.77 U$8.3
MOSI  (via drill 0.4)
  Top 0.254: 34.78,6.58 R36.2 33.77,6.86 24.51,6.86 v23.24,8.13 | v27.43,8.89 28.32,9.78 U$6.11
  Top 0.406: U$9.D11 35.56,5.33 34.67,5.33 34.16,5.84 R36.2
  Bottom 0.254: U$8.2 22.22,10.91 22.22,10.35 22.23,10.35 22.23,10.29 23.24,9.27 v23.24,8.13 26.67,8.13 v27.43,8.89
N$1
  Bottom 0.61: AI_SSR.4 95.96,33.73 92.53,30.3 HV_REG2.2(TAB) 86.61,19.6 R25.2
N$2
  Bottom 0.61: 94.94,57.91 HV_REG1.2(TAB) 89.52,56.64 | 89.52,56.64 R13.2 | 89.52,56.64 88.25,57.91 TSAL_SSR.1
N$3
  Top 0.406: ON-LED.C R5.1
N$4  (via drill 0.4)
  Top 0.406: R39.2 56.78,6.11 v56.52,5.84
  Bottom 0.406: v56.52,5.84 56.52,5 U$1.2
N$5
  Bottom 0.61: R26.1 88.9,39.67 AI_SSR.2
N$6
  Bottom 0.61: AI_SSR.1 83.01,36.07 TSAL_SSR.2
N$7  (via drill 0.6)
  Top 0.61: v122.94,38.86 127.25,38.86 131.32,42.93 144.32,42.93 INDICATOR.1
  Bottom 0.61: AI_SSR.3 104.14,38.61 108.2,34.54 118.62,34.54 v122.94,38.86
N$8
  Bottom 0.61: R9.1 R8.1
N$9  (via drill 0.6)
  Top 0.61: v122.94,44.96 v122.94,53.59
  Bottom 0.61: R26.2 88.9,43.18 106.43,43.18 108.71,45.47 115.57,45.47 117.86,43.18 121.16,43.18 v122.94,44.96 | v122.94,53.59 129.24,53.59 THRESHOLD.2(TAB)
N$10
  Bottom 0.61: R14.1 R15.1
N$11
  Bottom 0.61: R15.2 R16.2
N$12
  Bottom 0.61: R18.1 R17.1
N$13
  Bottom 0.61: R19.2 R18.2
N$14
  Bottom 0.61: R10.2 R9.2
N$15
  Bottom 0.61: R23.1 R22.1 98.03,18.66 99.44,20.07 HV_REG2.3 99.31,23.24
N$16
  Bottom 0.61: R11.2 R12.2
N$17
  Bottom 0.61: R13.1 R12.1
N$18
  Bottom 0.61: R10.1 HV_REG1.3 | R10.1 | R10.1 100.84,47.75 R11.1
N$19
  Bottom 0.61: R24.2 R23.2
N$20
  Bottom 0.61: R24.1 R25.1
N$21
  Bottom 0.61: R21.2 R22.2
N$22
  Bottom 0.61: R16.1 138.94,39.89 R17.2 136.4,41.9 132.33,45.97 THRESHOLD.1
N$23
  Bottom 0.61: R20.1 R21.1
N$25  (via drill 0.4)
  Top 0.406: U$7.1 7.24,5.71 7.62,5.33 v8.13,5.33
  Bottom 0.406: v8.13,5.33 15.24,5.33 U$9.D3(CANTX)
N$26
  Top 0.406: R30.2 7.24,13.33 U$7.8
N$27
  Top 0.406: R28.1 C8.2
N$28
  Top 0.406: R29.1 C9.2
N$29  (via drill 0.4)
  Top 0.406: v46.48,2.41 LED.C
  Bottom 0.406: R31.1 v46.48,2.41
N$31
  Bottom 0.254: R33.1 23.48,14.35 U$8.16
N$32
  Bottom 0.254: U$8.15 22.22,15.15 22.22,15.71 22.42,15.9 22.51,16 23.11,16 23.7,15.42 26.41,15.42 26.55,15.56
  Bottom 0.406: R34.1 26.55,15.56 R33.2
N$33  (via drill 0.4)
  Top 0.254: v18.29,20.32 17.27,21.34 15.75,21.34 14.6,22.49 14.6,22.88 R35.1 14.48,22.98 U$2.22
  Bottom 0.254: v18.29,20.32 18.29,17.53 19.71,16.11 U$8.10
N$34  (via drill 0.4)
  Top 0.254: v20.83,20.32 18.29,22.86 R35.2 15.75,23.51 U$2.23
  Bottom 0.254: U$8.11 20.21,16.14 20.83,16.76 v20.83,20.32
N$35
  Top 0.254: C4.1 18.66,24.14 U$2.24
N$36
  Top 0.406: U$9.D4(CANRX) 17.65,5.46 11.81,5.46 11.05,6.22 U$7.4
N$37
  Top 0.406: LED.A 42.51,1.78 28.19,1.78 27.18,2.79 U$9.D7(RX3)
N$38  (via drill 0.4)
  Top 0.406: U$10.WDO 38.61,13.08 38.99,12.7 44.83,12.7 45.78,11.75 47.39,11.75 U$11.1 48.69,10.44 v49.88,10.44
  Bottom 0.406: R38.2 49.88,11.54 v49.88,10.44
N$40  (via drill 0.4)
  Top 0.406: U$9.A8 17.02,15.88 19.81,13.08 33.02,13.08 v33.4,12.7 | v35.69,12.32 36.45,11.56 v36.45,10.16 | U$11.4 47.45,3.56 v41.78,3.56
  Bottom 0.406: v41.78,3.56 41.27,3.05 41.27,2.41 40.64,1.78 38.99,1.78 38.61,2.16 38.61,4.83 36.83,6.6 36.83,9.78 v36.45,10.16 | v33.4,12.7 34.04,12.06 35.43,12.06 v35.69,12.32
N$42  (via drill 0.4)
  Top 0.406: IMD-OK.A 58.71,31.02 v59.64,31.95
  Bottom 0.254: IC2.2 IC2.1
  Bottom 0.406: IC2.1 60.6,30.99 v59.64,31.95
N$43  (via drill 0.5)
  Top 0.406: BMS-OK.A 54.45,29.72 v53.85,29.72
  Bottom 0.406: IC2.7 v53.85,29.72
  Bottom 0.61: IC2.6 IC2.7
N$44
  Top 0.406: BMS-OK.C R4.1
N$45
  Top 0.406: IMD-OK.C R3.2
N$50  (via drill 0.4)
  Top 0.406: U$9.A0 39.24,16.89 39.88,16.89 U$10.WDI 40.51,16.64 v41.15,17.27
  Bottom 0.406: R42.1 41.77,17.9 v41.15,17.27
OKHS  (via drill 0.4, 0.5, 0.55)
  Top 0.406: 63.78,28.47 v63.75,28.45
  Top 0.61: v65.79,21.59 64.83,21.59 62.77,23.65 62.77,27.46 63.78,28.47 | v63.75,28.45 62.74,29.46 v62.74,43.43
  Bottom 0.406: IC2.3 v63.75,28.45 | 54.1,2.41 R41.1 55,3.43 57.28,3.43 61.28,7.43
  Bottom 0.61: MAIN.7 30.23,56.01 30.23,49.53 32,47.75 35.05,47.75 36.07,46.74 36.07,45.21 37.34,43.94 62.23,43.94 v62.74,43.43 | v65.79,21.59 68.07,19.3 68.07,12.95 66.8,11.68 65.53,11.68 61.28,7.43 61.09,7.24 IMD.P$5
SCK  (via drill 0.4)
  Top 0.406: U$6.13 30.86,9.65 v30.1,8.89
  Bottom 0.254: U$8.4 21.21,8
  Bottom 0.406: U$9.D13 39.88,17.78 38.61,16.51 33.78,16.51 31.5,14.22 31.5,10.29 v30.1,8.89 29.46,8.26 27.94,8.26 27,7.32 21.89,7.32 21.21,8
SHUTDOWN6
  Bottom 1.016: INTERLOCK.1 48.94,53.77 51.18,56.01 51.18,60.71 50.16,61.72 36.95,61.72 MAIN.1
SHUTDOWN7  (via drill 0.55)
  Top 0.61: v63.5,7.62 61.47,9.65 61.47,45.47 58.42,48.51 D1.A
  Top 1.016: INTERLOCK.2 57.4,50.25 D1.A
  Bottom 0.61: D2.C 64.89,7.62 v63.5,7.62 64.14,6.99 64.14,4.45 66.55,2.03 165.1,2.03 U$12.COIL+
  Bottom 1.016: RELAYS.1 42.89,53.77 INTERLOCK.2
SHUTDOWN7_EXT_OUT
  Top 1.016: MAIN.2 35.76,54.05 38.1,56.39 42.16,56.39 47.24,51.31 D1.C
TEMP_SENSE_1  (via drill 0.4)
  Top 0.406: CURRENT1.3 41.13,38.48 39.24,38.48 38.35,37.59 v38.35,26.57 | U$6.2 33.53,16 v33.53,20.32
  Bottom 0.406: v33.53,20.32 33.53,22.23 35.56,24.26 35.56,25.15 36.99,26.57 v38.35,26.57
TEMP_SENSE_2  (via drill 0.4)
  Top 0.406: U$6.4 30.86,16.64 30.38,17.12 29.19,17.12 28.45,17.86 28.45,20.07 30.35,21.97 v35.56,21.97
  Bottom 0.406: CURRENT2.3 45.42,24.59 42.8,21.97 v35.56,21.97
TRIM
  Bottom 0.406: TRIM-.1 U$5.7TRIM 64.64,30.36 TRIM+.1
TSAL+
  Bottom 0.61: TSAL_SSR.3 58.42,55.37 54.86,51.82 36.58,51.82 34.61,49.85 MAIN.3
TSAL_1  (via drill 0.55)
  Top 0.61: v66.04,43.43 61.72,47.75 61.72,55.37 v64.26,57.91
  Bottom 0.406: U$5.6SENSE+ 64.64,27.04 TRIM+.2
  Bottom 0.61: v64.26,57.91 TSAL_SSR.4 | v66.04,43.43 68.33,41.15 68.33,27.43 65.79,24.89 U$5.6SENSE+ U$5.5VOUT+

### Text on the board
bTest: DANGER HIGH VOLTAGE | DANGER HIGH VOLTAGE
tDocu: 2018_hv_board_rev3 | HV- Area | FUSED- | IMD- | DISCHARGE- | UNFUSED- | Designed by Nathan Cheek | TS | GLV | DANGER / HIGH / VOLTAGE | isoSPI | isoSPI | DANGER HIGH VOLTAGE | FH JUMP | - | isoSPI | Grounded Low Voltage PCB Area | INDICATOR | TRACTIVE SYSTEM / PCB AREA | UNFUSED+ | FUSED+ | IMD+ | HV+ Area | FH JUMP | + | GLV | TS | TS | GLV | DISCHARGE+ | TS | TS | GLV | TS | GLV | GLV | GLV | TS
bDocu: isoSPI | isoSPI | DANGER HIGH VOLTAGE | GLV | TS | isoSPI | Grounded Low Voltage PCB Area | TRACTIVE SYSTEM / PCB AREA | isoSPI | isoSPI | GLV | TS | TS | GLV | TS | GLV | TS | TS | GLV | TS | GLV | GLV